# Altium schematic sheet Power_Supply.SchDoc
size 300 x 200 mm; SheetNumber: 3; SheetTotal: 2
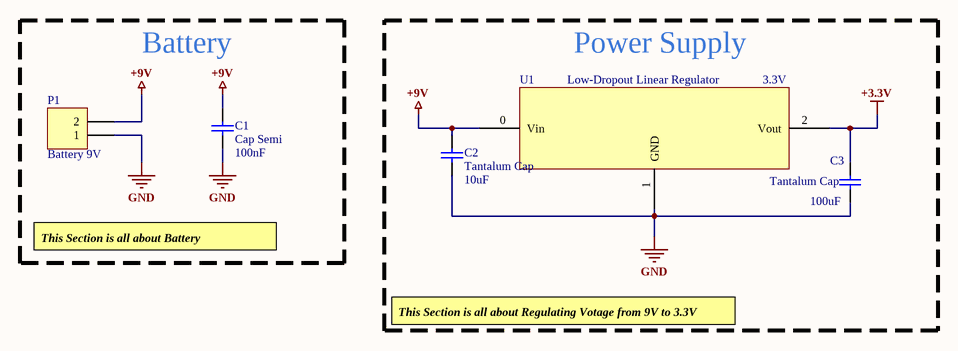
[diagram p0: Power_Supply.SchDoc]

## Parts
C1  Cap Semi  value 100nF  [C1206]
C2  Tantalum Cap  value 10uF  [C1206]
C3  Tantalum Cap  value 100uF  [C1206]
P1  Battery 9V  [HDR1X2H]
U1  Low-Dropout Linear Regulator  Output Voltage: 3.3V  [4-Pin SOT]

## Blocks framed on the sheet
Battery: C1 P1
Power Supply: C2 C3 U1

## Nets
+3.3V: C3.2 U1.2(Vout)
+9V: C1.2 C2.2 P1.2 U1.0(Vin)
GND: C1.1 C2.1 C3.1 P1.1 U1.1(GND)

## Notes on the sheet
- This Section is all about Battery
- This Section is all about Regulating Votage from 9V to 3.3V

## Library data of the parts
C1-C3 = Cap Semi: Capacitor (Semiconductor SIM Model); Published: 8-Jun-2000; LatestRevisionDate: 29-May-2009; LatestRevisionNote: IPC-7351 Footprint Added.; PackageReference: C1206; Publisher: Altium Limited; PackageDescription: Chip Capacitor
P1 = Header 2H: Header, 2-Pin, Right Angle; LatestRevisionDate: 17-Jul-2002; LatestRevisionNote: Re-released for DXP Platform.; Publisher: Altium Limited; Voltage: 9V
U1 = LM1117: The LM1117 is a low dropout voltage regulator with a / dropout of 1.2 V at 800 mA of load current.